# Altium schematic sheet IMX6DLWBED.SchDoc
size A4
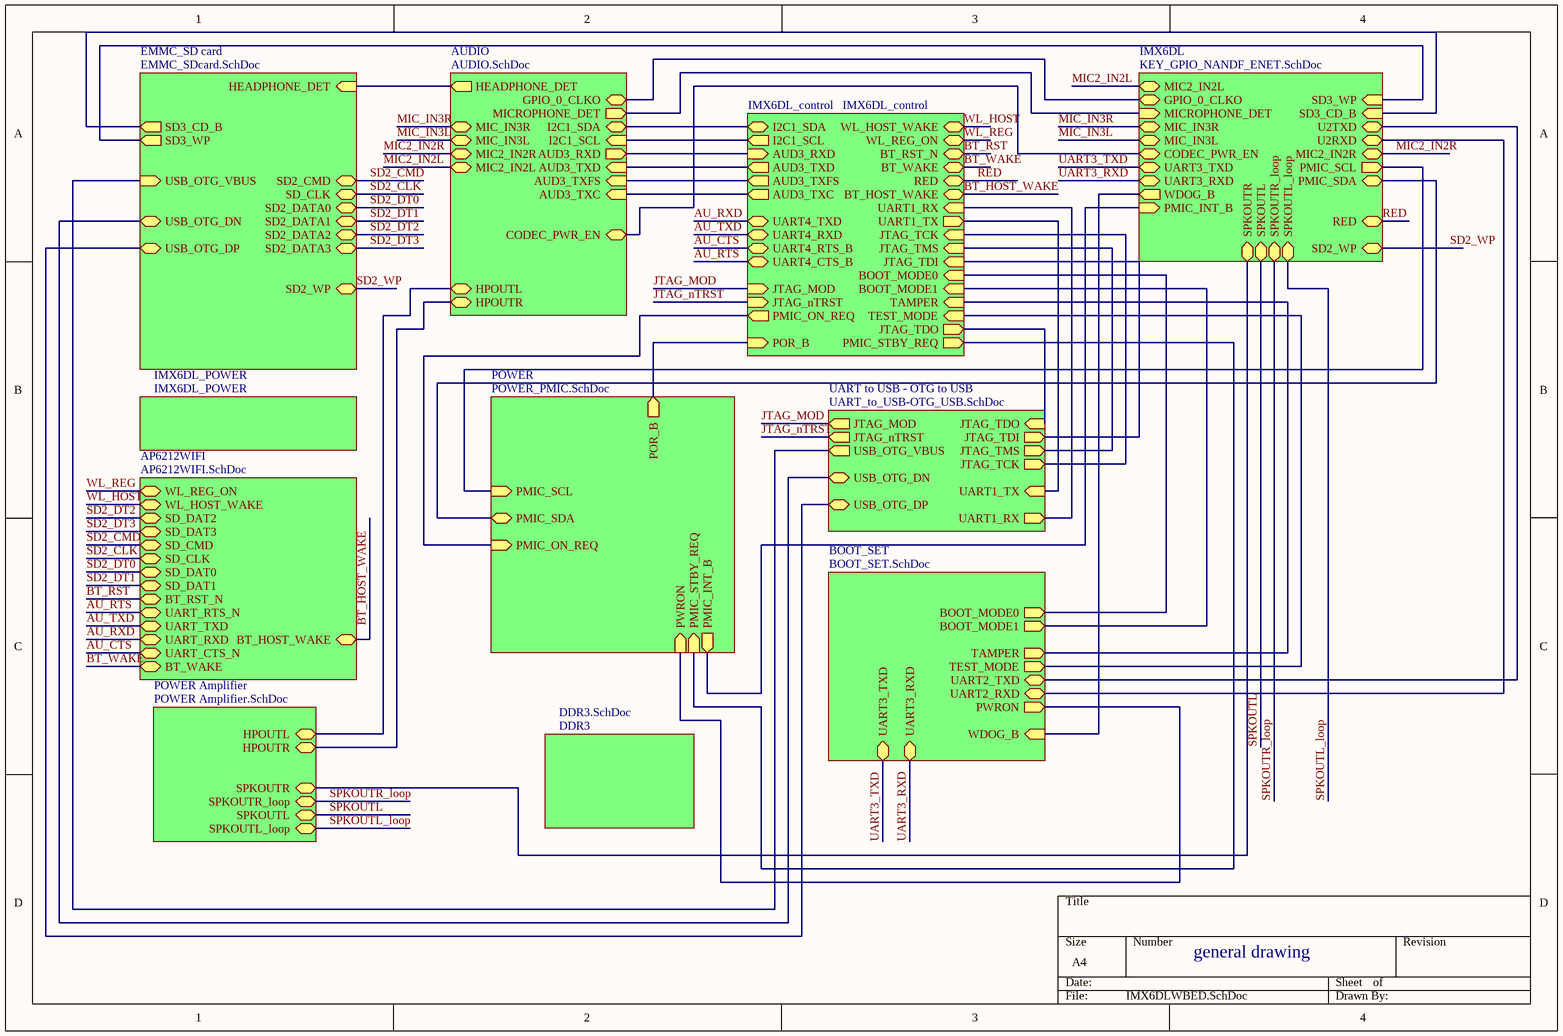
[diagram p0: IMX6DLWBED.SchDoc]

## Sub-sheets
AP6212WIFI = AP6212WIFI.SchDoc: SD_DAT2, SD_DAT3, SD_CMD, SD_CLK, SD_DAT0, SD_DAT1, BT_RST_N, UART_RTS_N, UART_TXD, UART_RXD, UART_CTS_N, BT_WAKE, WL_HOST_WAKE, WL_REG_ON, BT_HOST_WAKE
AUDIO = AUDIO.SchDoc: GPIO_0_CLKO, AUD3_TXC (in), AUD3_TXFS (in), AUD3_TXD (in), AUD3_RXD (out), I2C1_SCL (in), I2C1_SDA, MICROPHONE_DET (out), HEADPHONE_DET (out), CODEC_PWR_EN, HPOUTL, HPOUTR, MIC_IN3R, MIC_IN3L, MIC2_IN2R, MIC2_IN2L
BOOT_SET = BOOT_SET.SchDoc: BOOT_MODE0 (out), BOOT_MODE1 (out), TAMPER (out), TEST_MODE (out), PWRON (out), WDOG_B (in), UART2_TXD, UART2_RXD, UART3_TXD, UART3_RXD
DDR3 = DDR3.SchDoc: no entries
EMMC_SD card = EMMC_SDcard.SchDoc: HEADPHONE_DET (in), SD3_CD_B (out), SD3_WP (out), USB_OTG_VBUS (in), USB_OTG_DN, USB_OTG_DP, SD2_DATA0, SD2_DATA1, SD2_DATA2, SD2_DATA3, SD2_WP, SD_CLK, SD2_CMD
IMX6DL = KEY_GPIO_NANDF_ENET.SchDoc: MICROPHONE_DET (in), GPIO_0_CLKO, SD3_WP (in), PMIC_INT_B (in), SD3_CD_B (in), PMIC_SCL (out), PMIC_SDA, WDOG_B (out), SD2_WP, CODEC_PWR_EN, U2TXD, U2RXD, UART3_TXD, UART3_RXD, MIC_IN3R, MIC_IN3L, MIC2_IN2R, MIC2_IN2L, SPKOUTR, SPKOUTR_loop, SPKOUTL, SPKOUTL_loop, RED
IMX6DL_control = IMX6DL_control: AUD3_TXC (out), AUD3_TXD (out), AUD3_TXFS (out), AUD3_RXD (in), I2C1_SDA, I2C1_SCL (out), UART1_TX (out), UART1_RX (in), TEST_MODE (in), BOOT_MODE0 (in), BOOT_MODE1 (in), TAMPER (in), POR_B (in), PMIC_STBY_REQ (out), PMIC_ON_REQ (out), JTAG_TCK (in), JTAG_TMS (in), JTAG_TDI (in), JTAG_TDO (out), JTAG_nTRST (in), JTAG_MOD (in), UART4_TXD, UART4_RXD, UART4_RTS_B, UART4_CTS_B, WL_HOST_WAKE, WL_REG_ON, BT_RST_N, BT_WAKE, BT_HOST_WAKE, RED
IMX6DL_POWER = IMX6DL_POWER: no entries
POWER = POWER_PMIC.SchDoc: PMIC_INT_B (out), POR_B (out), PMIC_STBY_REQ (in), PMIC_SCL (in), PMIC_SDA, PMIC_ON_REQ (in), PWRON (in)
POWER Amplifier = POWER Amplifier.SchDoc: HPOUTL, HPOUTR, SPKOUTR, SPKOUTR_loop, SPKOUTL, SPKOUTL_loop
UART to USB - OTG to USB = UART_to_USB-OTG_USB.SchDoc: UART1_TX (in), UART1_RX (out), USB_OTG_VBUS (out), USB_OTG_DN, USB_OTG_DP, JTAG_nTRST (out), JTAG_TDI (out), JTAG_TMS (out), JTAG_TCK (out), JTAG_TDO (in), JTAG_MOD (out)

## Nets
AU_CTS: sheet IMX6DL_control/UART4_RTS_B, sheet AP6212WIFI/UART_CTS_N
AU_RTS: sheet IMX6DL_control/UART4_CTS_B, sheet AP6212WIFI/UART_RTS_N
AU_RXD: sheet IMX6DL_control/UART4_TXD, sheet AP6212WIFI/UART_RXD
AU_TXD: sheet IMX6DL_control/UART4_RXD, sheet AP6212WIFI/UART_TXD
BT_HOST_WAKE: sheet IMX6DL_control/BT_HOST_WAKE, sheet AP6212WIFI/BT_HOST_WAKE
BT_RST: sheet IMX6DL_control/BT_RST_N, sheet AP6212WIFI/BT_RST_N
BT_WAKE: sheet IMX6DL_control/BT_WAKE, sheet AP6212WIFI/BT_WAKE
JTAG_MOD: sheet IMX6DL_control/JTAG_MOD, sheet UART to USB - OTG to USB/JTAG_MOD
JTAG_nTRST: sheet IMX6DL_control/JTAG_nTRST, sheet UART to USB - OTG to USB/JTAG_nTRST
MIC2_IN2L: sheet AUDIO/MIC2_IN2L, sheet IMX6DL/MIC2_IN2L
MIC2_IN2R: sheet AUDIO/MIC2_IN2R, sheet IMX6DL/MIC2_IN2R
MIC_IN3L: sheet AUDIO/MIC_IN3L, sheet IMX6DL/MIC_IN3L
MIC_IN3R: sheet AUDIO/MIC_IN3R, sheet IMX6DL/MIC_IN3R
RED: sheet IMX6DL_control/RED, sheet IMX6DL/RED
SD2_CLK: sheet EMMC_SD card/SD_CLK, sheet AP6212WIFI/SD_CLK
SD2_CMD: sheet EMMC_SD card/SD2_CMD, sheet AP6212WIFI/SD_CMD
SD2_DT0: sheet EMMC_SD card/SD2_DATA0, sheet AP6212WIFI/SD_DAT0
SD2_DT1: sheet EMMC_SD card/SD2_DATA1, sheet AP6212WIFI/SD_DAT1
SD2_DT2: sheet EMMC_SD card/SD2_DATA2, sheet AP6212WIFI/SD_DAT2
SD2_DT3: sheet EMMC_SD card/SD2_DATA3, sheet AP6212WIFI/SD_DAT3
SD2_WP: sheet IMX6DL/SD2_WP, sheet EMMC_SD card/SD2_WP
SPKOUTL: sheet IMX6DL/SPKOUTL, sheet POWER Amplifier/SPKOUTL
SPKOUTL_loop: sheet IMX6DL/SPKOUTL_loop, sheet POWER Amplifier/SPKOUTL_loop
SPKOUTR_loop: sheet IMX6DL/SPKOUTR_loop, sheet POWER Amplifier/SPKOUTR_loop
UART3_RXD: sheet IMX6DL/UART3_RXD, sheet BOOT_SET/UART3_RXD
UART3_TXD: sheet IMX6DL/UART3_TXD, sheet BOOT_SET/UART3_TXD
WL_HOST: sheet IMX6DL_control/WL_HOST_WAKE, sheet AP6212WIFI/WL_HOST_WAKE
WL_REG: sheet IMX6DL_control/WL_REG_ON, sheet AP6212WIFI/WL_REG_ON
(unnamed): sheet IMX6DL_control/AUD3_TXC, sheet AUDIO/AUD3_TXC
(unnamed): sheet IMX6DL_control/AUD3_TXD, sheet AUDIO/AUD3_TXD
(unnamed): sheet IMX6DL_control/AUD3_TXFS, sheet AUDIO/AUD3_TXFS
(unnamed): sheet IMX6DL_control/AUD3_RXD, sheet AUDIO/AUD3_RXD
(unnamed): sheet IMX6DL_control/I2C1_SDA, sheet AUDIO/I2C1_SDA
(unnamed): sheet IMX6DL_control/I2C1_SCL, sheet AUDIO/I2C1_SCL
(unnamed): sheet IMX6DL_control/UART1_TX, sheet UART to USB - OTG to USB/UART1_TX
(unnamed): sheet IMX6DL_control/UART1_RX, sheet UART to USB - OTG to USB/UART1_RX
(unnamed): sheet IMX6DL_control/TEST_MODE, sheet BOOT_SET/TEST_MODE
(unnamed): sheet IMX6DL_control/BOOT_MODE0, sheet BOOT_SET/BOOT_MODE0
(unnamed): sheet IMX6DL_control/BOOT_MODE1, sheet BOOT_SET/BOOT_MODE1
(unnamed): sheet IMX6DL_control/TAMPER, sheet BOOT_SET/TAMPER
(unnamed): sheet IMX6DL_control/POR_B, sheet POWER/POR_B
(unnamed): sheet IMX6DL_control/PMIC_STBY_REQ, sheet POWER/PMIC_STBY_REQ
(unnamed): sheet IMX6DL_control/PMIC_ON_REQ, sheet POWER/PMIC_ON_REQ
(unnamed): sheet IMX6DL_control/JTAG_TCK, sheet UART to USB - OTG to USB/JTAG_TCK
(unnamed): sheet IMX6DL_control/JTAG_TMS, sheet UART to USB - OTG to USB/JTAG_TMS
(unnamed): sheet IMX6DL_control/JTAG_TDI, sheet UART to USB - OTG to USB/JTAG_TDI
(unnamed): sheet IMX6DL_control/JTAG_TDO, sheet UART to USB - OTG to USB/JTAG_TDO
(unnamed): sheet AUDIO/GPIO_0_CLKO, sheet IMX6DL/GPIO_0_CLKO
(unnamed): sheet AUDIO/MICROPHONE_DET, sheet IMX6DL/MICROPHONE_DET
(unnamed): sheet AUDIO/HEADPHONE_DET, sheet EMMC_SD card/HEADPHONE_DET
(unnamed): sheet AUDIO/CODEC_PWR_EN, sheet IMX6DL/CODEC_PWR_EN
(unnamed): sheet AUDIO/HPOUTL, sheet POWER Amplifier/HPOUTL
(unnamed): sheet AUDIO/HPOUTR, sheet POWER Amplifier/HPOUTR
(unnamed): sheet IMX6DL/SD3_WP, sheet EMMC_SD card/SD3_WP
(unnamed): sheet IMX6DL/PMIC_INT_B, sheet POWER/PMIC_INT_B
(unnamed): sheet IMX6DL/SD3_CD_B, sheet EMMC_SD card/SD3_CD_B
(unnamed): sheet IMX6DL/PMIC_SCL, sheet POWER/PMIC_SCL
(unnamed): sheet IMX6DL/PMIC_SDA, sheet POWER/PMIC_SDA
(unnamed): sheet IMX6DL/WDOG_B, sheet BOOT_SET/WDOG_B
(unnamed): sheet IMX6DL/U2TXD, sheet BOOT_SET/UART2_TXD
(unnamed): sheet IMX6DL/U2RXD, sheet BOOT_SET/UART2_RXD
(unnamed): sheet IMX6DL/SPKOUTR, sheet POWER Amplifier/SPKOUTR
(unnamed): sheet POWER/PWRON, sheet BOOT_SET/PWRON
(unnamed): sheet EMMC_SD card/USB_OTG_VBUS, sheet UART to USB - OTG to USB/USB_OTG_VBUS
(unnamed): sheet EMMC_SD card/USB_OTG_DN, sheet UART to USB - OTG to USB/USB_OTG_DN
(unnamed): sheet EMMC_SD card/USB_OTG_DP, sheet UART to USB - OTG to USB/USB_OTG_DP

## Notes on the sheet
- general drawing